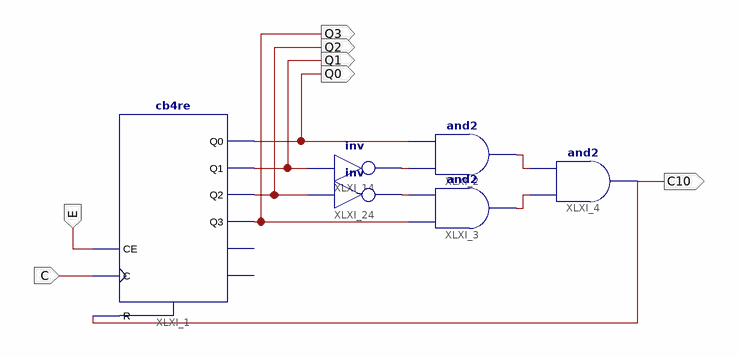
[diagram p0: schematic sheet 1]
// Xilinx ISE schematic contador10.sch (spartan3e) as structural Verilog: 6 symbols, 7 ports
module contador10 (
  input  C,
  input  E,
  output C10,
  output Q1,
  output Q0,
  output Q2,
  output Q3
);

  wire XLXN_3, XLXN_4, XLXN_20, XLXN_42;

  cb4re XLXI_1 (.C(C), .CE(E), .R(C10), .Q0(Q0), .Q1(Q1), .Q2(Q2), .Q3(Q3));  // open: CEO, TC
  and XLXI_2 (XLXN_3, XLXN_20, Q0);
  and XLXI_3 (XLXN_4, Q3, XLXN_42);
  and XLXI_4 (C10, XLXN_4, XLXN_3);
  not XLXI_14 (XLXN_20, Q1);
  not XLXI_24 (XLXN_42, Q2);
endmodule
